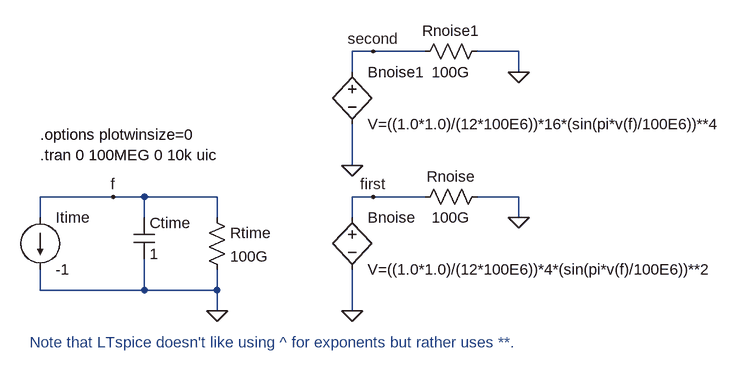
[diagram p0: schematic _Fig7_23_MSD.asc]
_Fig7_23_MSD.asc, the LTspice schematic file:
Version 4
SHEET 1 2740 696
WIRE 1120 -704 1088 -704
WIRE 1200 -704 1120 -704
WIRE 1344 -704 1280 -704
WIRE 1088 -672 1088 -704
WIRE 1344 -672 1344 -704
WIRE 1088 -528 1088 -592
WIRE 720 -480 608 -480
WIRE 768 -480 720 -480
WIRE 880 -480 768 -480
WIRE 1120 -480 1088 -480
WIRE 1200 -480 1120 -480
WIRE 1344 -480 1280 -480
WIRE 608 -448 608 -480
WIRE 768 -448 768 -480
WIRE 880 -448 880 -480
WIRE 1088 -448 1088 -480
WIRE 1344 -448 1344 -480
WIRE 608 -336 608 -368
WIRE 768 -336 768 -384
WIRE 768 -336 608 -336
WIRE 880 -336 880 -368
WIRE 880 -336 768 -336
WIRE 880 -304 880 -336
WIRE 1088 -304 1088 -368
FLAG 720 -480 f
FLAG 880 -304 0
FLAG 1088 -304 0
FLAG 1344 -448 0
FLAG 1120 -480 first
FLAG 1088 -528 0
FLAG 1344 -672 0
FLAG 1120 -704 second
SYMBOL current 608 -448 R0
WINDOW 123 0 0 Left 0
WINDOW 39 0 0 Left 0
SYMATTR InstName Itime
SYMATTR Value -1
SYMBOL cap 752 -448 R0
SYMATTR InstName Ctime
SYMATTR Value 1
SYMBOL res 864 -464 R0
SYMATTR InstName Rtime
SYMATTR Value 100G
SYMBOL bv 1088 -464 R0
SYMATTR InstName Bnoise
SYMATTR Value V=((1.0*1.0)/(12*100E6))*4*(sin(pi*v(f)/100E6))**2
SYMBOL res 1296 -496 R90
WINDOW 0 0 56 VBottom 0
WINDOW 3 32 56 VTop 0
SYMATTR InstName Rnoise
SYMATTR Value 100G
SYMBOL bv 1088 -688 R0
SYMATTR InstName Bnoise1
SYMATTR Value V=((1.0*1.0)/(12*100E6))*16*(sin(pi*v(f)/100E6))**4
SYMBOL res 1296 -720 R90
WINDOW 0 0 56 VBottom 0
WINDOW 3 32 56 VTop 0
SYMATTR InstName Rnoise1
SYMATTR Value 100G
TEXT 608 -544 Left 0 !.tran 0 100MEG 0 10k uic
TEXT 592 -256 Left 0 ;Note that LTspice doesn't like using ^ for exponents but rather uses **.
TEXT 608 -576 Left 0 !.options plotwinsize=0

The netlist it stands for:
* _Fig7_23_MSD.asc
Itime f 0 -1
Ctime f 0 1
Rtime f 0 100G
Bnoise first 0 V=((1.0*1.0)/(12*100E6))*4*(sin(pi*v(f)/100E6))**2
Rnoise 0 first 100G
Bnoise1 second 0 V=((1.0*1.0)/(12*100E6))*16*(sin(pi*v(f)/100E6))**4
Rnoise1 0 second 100G
.tran 0 100MEG 0 10k uic
* Note that LTspice doesn't like using ^ for exponents but rather uses **.
.options plotwinsize=0
.backanno
.end